# Altium schematic sheet fpga-top.SchDoc
size Letter; CompanyName: Brinton Engineering, LLC; Address1: 3479 Edison Way; Address2: Menlo Park CA 94025; Address3: +1 (877) 778-8435; Address4: brintonengineering.com; Revision: 1; SheetNumber: 1; SheetTotal: 1
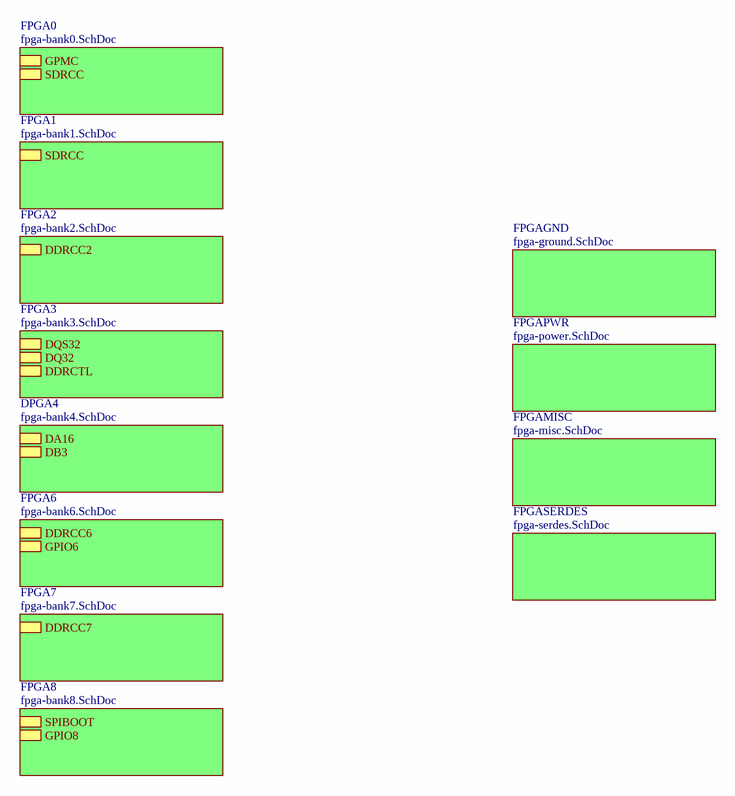
[diagram p0: fpga-top.SchDoc]

## Sub-sheets
DPGA4 = fpga-bank4.SchDoc: DA16 (harness DA16), DB3 (harness DB3)
FPGA0 = fpga-bank0.SchDoc: GPMC (harness GPMC), SDRCC (harness SDRCC)
FPGA1 = fpga-bank1.SchDoc: SDRCC (harness SDRCC)
FPGA2 = fpga-bank2.SchDoc: DDRCC2 (harness DDRCC)
FPGA3 = fpga-bank3.SchDoc: DQS32 (harness DQS32), DQ32 (harness DQ32), DDRCTL (harness DDRCTL)
FPGA6 = fpga-bank6.SchDoc: DDRCC6 (harness DDRCC), GPIO6 (harness GPIO8)
FPGA7 = fpga-bank7.SchDoc: DDRCC7 (harness DDRCC)
FPGA8 = fpga-bank8.SchDoc: SPIBOOT (harness SPIBOOT), GPIO8 (harness GPIO8)
FPGAGND = fpga-ground.SchDoc: no entries
FPGAMISC = fpga-misc.SchDoc: no entries
FPGAPWR = fpga-power.SchDoc: no entries
FPGASERDES = fpga-serdes.SchDoc: no entries

## Notes on the sheet
- Title
- Engineer
- Revision
- Drawn By
- Checked By
- Date
- Sheet
- of